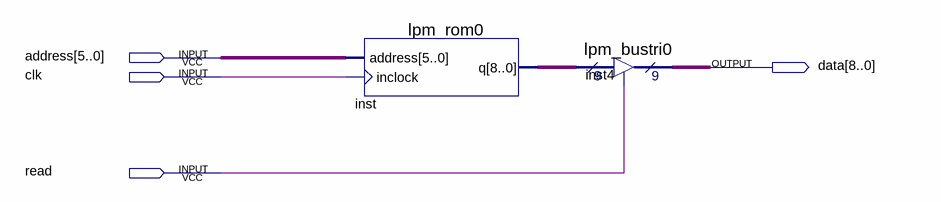
[diagram p0: schematic sheet]
// Quartus schematic rom.bdf as structural Verilog: 2 symbols, 4 pins
module rom (
  input  [5:0] address,
  input  clk,
  input  read,
  output [8:0] data
);

  wire [8:0] inst_q;

  lpm_rom0 inst (.address(address), .inclock(clk), .q(inst_q));
  lpm_bustri0 inst4 (.enabledt(read), .data(inst_q), .tridata(data));
endmodule
